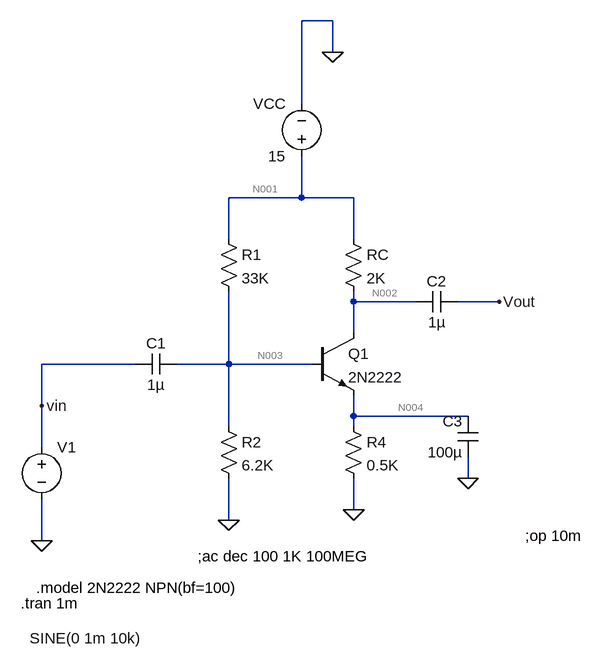
[diagram p0: schematic Single Stage BJT Ampr.asc]
Single Stage BJT Ampr.asc, the LTspice schematic file:
Version 4
SHEET 1 880 680
WIRE 288 -480 240 -480
WIRE 288 -432 288 -480
WIRE 240 -352 240 -480
WIRE 240 -208 240 -272
WIRE 240 -208 128 -208
WIRE 320 -208 240 -208
WIRE 128 -144 128 -208
WIRE 320 -144 320 -208
WIRE 320 -48 320 -64
WIRE 416 -48 320 -48
WIRE 544 -48 480 -48
WIRE 320 0 320 -48
WIRE -16 48 -160 48
WIRE 128 48 128 -64
WIRE 128 48 48 48
WIRE 256 48 128 48
WIRE -160 112 -160 48
WIRE 320 128 320 96
WIRE 496 128 320 128
WIRE 128 144 128 48
WIRE 320 144 320 128
WIRE -160 176 -160 112
WIRE 496 224 496 192
WIRE 320 272 320 224
WIRE 128 288 128 224
WIRE -160 320 -160 256
FLAG -160 320 0
FLAG 128 288 0
FLAG 320 272 0
FLAG 496 224 0
FLAG 288 -432 0
FLAG -160 112 vin
FLAG 544 -48 Vout
SYMBOL voltage -160 160 R0
WINDOW 3 -18 310 Left 2
WINDOW 123 -18 282 Left 2
WINDOW 39 0 0 Left 0
SYMATTR Value SINE(0 1m 10k)
SYMATTR InstName V1
SYMBOL voltage 240 -256 R180
WINDOW 0 24 96 Left 2
WINDOW 3 24 16 Left 2
WINDOW 123 0 0 Left 0
WINDOW 39 0 0 Left 0
SYMATTR InstName VCC
SYMATTR Value 15
SYMBOL cap 48 32 R90
WINDOW 0 0 32 VBottom 2
WINDOW 3 32 32 VTop 2
SYMATTR InstName C1
SYMATTR Value 1µ
SYMBOL cap 480 -64 R90
WINDOW 0 0 32 VBottom 2
WINDOW 3 32 32 VTop 2
SYMATTR InstName C2
SYMATTR Value 1µ
SYMBOL cap 512 192 R180
WINDOW 0 24 56 Left 2
WINDOW 3 24 8 Left 2
SYMATTR InstName C3
SYMATTR Value 100µ
SYMBOL res 112 -160 R0
SYMATTR InstName R1
SYMATTR Value 33K
SYMBOL res 112 128 R0
SYMATTR InstName R2
SYMATTR Value 6.2K
SYMBOL res 304 -160 R0
SYMATTR InstName RC
SYMATTR Value 2K
SYMBOL res 304 128 R0
SYMATTR InstName R4
SYMATTR Value 0.5K
SYMBOL npn 256 0 R0
SYMATTR InstName Q1
SYMATTR Value 2N2222
TEXT -168 392 Left 2 !.model 2N2222 NPN(bf=100)
TEXT -192 416 Left 2 !.tran 1m
TEXT 80 344 Left 2 !;ac dec 100 1K 100MEG
TEXT 584 312 Left 2 !;op 10m

The netlist it stands for:
* Single Stage BJT Ampr.asc
V1 vin 0 SINE(0 1m 10k)
VCC N001 0 15
C1 N003 vin 1µ
C2 Vout N002 1µ
C3 0 N004 100µ
R1 N001 N003 33K
R2 N003 0 6.2K
RC N001 N002 2K
R4 N004 0 0.5K
Q1 N002 N003 N004 0 2N2222
.model NPN NPN
.model PNP PNP
.lib standard.bjt
.model 2N2222 NPN(bf=100)
.tran 1m
;ac dec 100 1K 100MEG
;op 10m
.backanno
.end

* Results of the author's LTspice run, read from the files saved beside the schematic
* Operating Point, zero values left out:
*   V(n001) = 15 V
*   V(n003) = 2.225 V
*   V(vout) = 9.36 µV
*   V(n002) = 9.36 V
*   V(n004) = 1.424 V
*   Ic(Q1) = 2.82 mA
*   Ib(Q1) = 28.2 µA
*   Ie(Q1) = -2.848 mA
*   I(R4) = 2.848 mA
*   I(Rc) = 2.82 mA
*   I(R2) = 358.9 µA
*   I(R1) = 387.1 µA
*   I(Vcc) = -3.207 mA
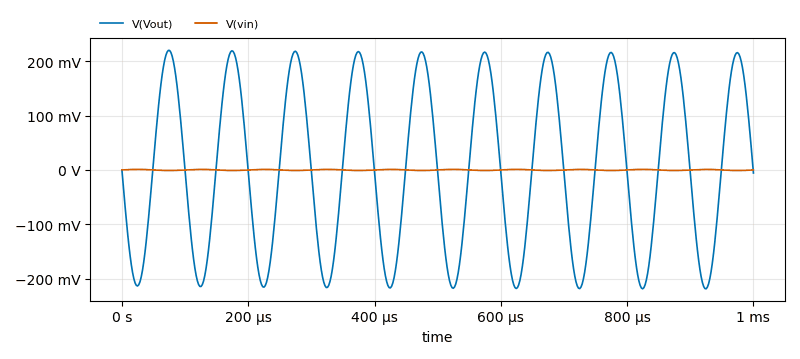
[diagram p1: Transient Analysis of Single Stage BJT Ampr.asc, plotted from the saved traces]
* Transient Analysis, 1 run:
*   V(Vout): min -218.9 mV, max 220.3 mV, average 2.346 mV, rms 153.8 mV, last -5.629 mV
*   V(vin): min -1 mV, max 1 mV, average 0 V, rms 707.1 µV, last 0 V